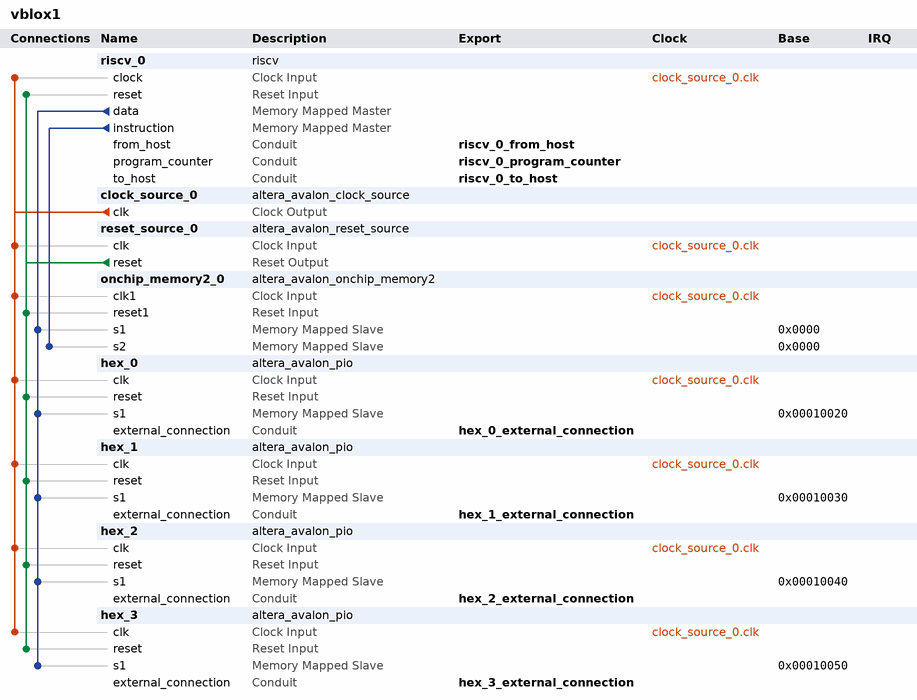
[diagram p0: system contents]
# Platform Designer (Qsys) system vblox1, Cyclone IV E EP4CE115F29C7
# Parameters at their usual value, and those the tool derives, are not listed.
package require -exact qsys 15.0
create_system vblox1
set_project_property DEVICE_FAMILY {Cyclone IV E}
set_project_property DEVICE EP4CE115F29C7

add_instance riscv_0 riscv 1.0
set_instance_parameter_value riscv_0 BRANCH_PREDICTION false
set_instance_parameter_value riscv_0 BTB_SIZE 0
set_instance_parameter_value riscv_0 DIVIDE_ENABLE 1
set_instance_parameter_value riscv_0 FORWARD_ALU_ONLY 1
set_instance_parameter_value riscv_0 COUNTER_LENGTH 64
set_instance_parameter_value riscv_0 MULTIPLY_ENABLE 1
set_instance_parameter_value riscv_0 PIPELINE_STAGES 4
set_instance_parameter_value riscv_0 REGISTER_SIZE 32
set_instance_parameter_value riscv_0 RESET_VECTOR 512
set_instance_parameter_value riscv_0 SHIFTER_MAX_CYCLE 1

add_instance clock_source_0 altera_avalon_clock_source 15.0
set_instance_parameter_value clock_source_0 CLOCK_RATE 1000
set_instance_parameter_value clock_source_0 CLOCK_UNIT 1000000

add_instance reset_source_0 altera_avalon_reset_source 15.0
set_instance_parameter_value reset_source_0 ASSERT_HIGH_RESET 1
set_instance_parameter_value reset_source_0 INITIAL_RESET_CYCLES 0

add_instance onchip_memory2_0 altera_avalon_onchip_memory2 15.0
set_instance_parameter_value onchip_memory2_0 dataWidth 32
set_instance_parameter_value onchip_memory2_0 dualPort true
set_instance_parameter_value onchip_memory2_0 initMemContent true
set_instance_parameter_value onchip_memory2_0 initializationFileName test.hex
set_instance_parameter_value onchip_memory2_0 memorySize 65536
set_instance_parameter_value onchip_memory2_0 singleClockOperation true
set_instance_parameter_value onchip_memory2_0 useNonDefaultInitFile true

add_instance hex_0 altera_avalon_pio 15.0
set_instance_parameter_value hex_0 direction Output
set_instance_parameter_value hex_0 width 32

add_instance hex_1 altera_avalon_pio 15.0
set_instance_parameter_value hex_1 direction Output
set_instance_parameter_value hex_1 width 32

add_instance hex_2 altera_avalon_pio 15.0
set_instance_parameter_value hex_2 direction Output
set_instance_parameter_value hex_2 width 32

add_instance hex_3 altera_avalon_pio 15.0
set_instance_parameter_value hex_3 direction Output
set_instance_parameter_value hex_3 width 32

# connections
add_connection clock_source_0.clk hex_0.clk clock
add_connection clock_source_0.clk hex_1.clk clock
add_connection clock_source_0.clk hex_2.clk clock
add_connection clock_source_0.clk hex_3.clk clock
add_connection clock_source_0.clk onchip_memory2_0.clk1 clock
add_connection clock_source_0.clk reset_source_0.clk clock
add_connection clock_source_0.clk riscv_0.clock clock
add_connection reset_source_0.reset hex_0.reset reset
add_connection reset_source_0.reset hex_1.reset reset
add_connection reset_source_0.reset hex_2.reset reset
add_connection reset_source_0.reset hex_3.reset reset
add_connection reset_source_0.reset onchip_memory2_0.reset1 reset
add_connection reset_source_0.reset riscv_0.reset reset
add_connection riscv_0.data hex_0.s1 avalon
set_connection_parameter_value riscv_0.data/hex_0.s1 baseAddress 0x00010020
add_connection riscv_0.data hex_1.s1 avalon
set_connection_parameter_value riscv_0.data/hex_1.s1 baseAddress 0x00010030
add_connection riscv_0.data hex_2.s1 avalon
set_connection_parameter_value riscv_0.data/hex_2.s1 baseAddress 0x00010040
add_connection riscv_0.data hex_3.s1 avalon
set_connection_parameter_value riscv_0.data/hex_3.s1 baseAddress 0x00010050
add_connection riscv_0.data onchip_memory2_0.s1 avalon
set_connection_parameter_value riscv_0.data/onchip_memory2_0.s1 baseAddress 0x0000
add_connection riscv_0.instruction onchip_memory2_0.s2 avalon
set_connection_parameter_value riscv_0.instruction/onchip_memory2_0.s2 baseAddress 0x0000

# exported interfaces
add_interface hex_0_external_connection conduit end
set_interface_property hex_0_external_connection EXPORT_OF hex_0.external_connection
add_interface hex_1_external_connection conduit end
set_interface_property hex_1_external_connection EXPORT_OF hex_1.external_connection
add_interface hex_2_external_connection conduit end
set_interface_property hex_2_external_connection EXPORT_OF hex_2.external_connection
add_interface hex_3_external_connection conduit end
set_interface_property hex_3_external_connection EXPORT_OF hex_3.external_connection
add_interface riscv_0_from_host conduit end
set_interface_property riscv_0_from_host EXPORT_OF riscv_0.from_host
add_interface riscv_0_program_counter conduit end
set_interface_property riscv_0_program_counter EXPORT_OF riscv_0.program_counter
add_interface riscv_0_to_host conduit end
set_interface_property riscv_0_to_host EXPORT_OF riscv_0.to_host

set_interconnect_requirement {$system} qsys_mm.clockCrossingAdapter HANDSHAKE
set_interconnect_requirement {$system} qsys_mm.insertDefaultSlave FALSE
set_interconnect_requirement {$system} qsys_mm.maxAdditionalLatency 1

save_system vblox1.qsys
